# Altium schematic sheet TFT Display Interface.SchDoc
size A4; Organization: TESLA Motors, INC; Address1: 3500 Deer Creek Road; Address2: Palo Alto, CA; Address4: U.S.A.; SheetNumber: 4; SheetTotal: 21
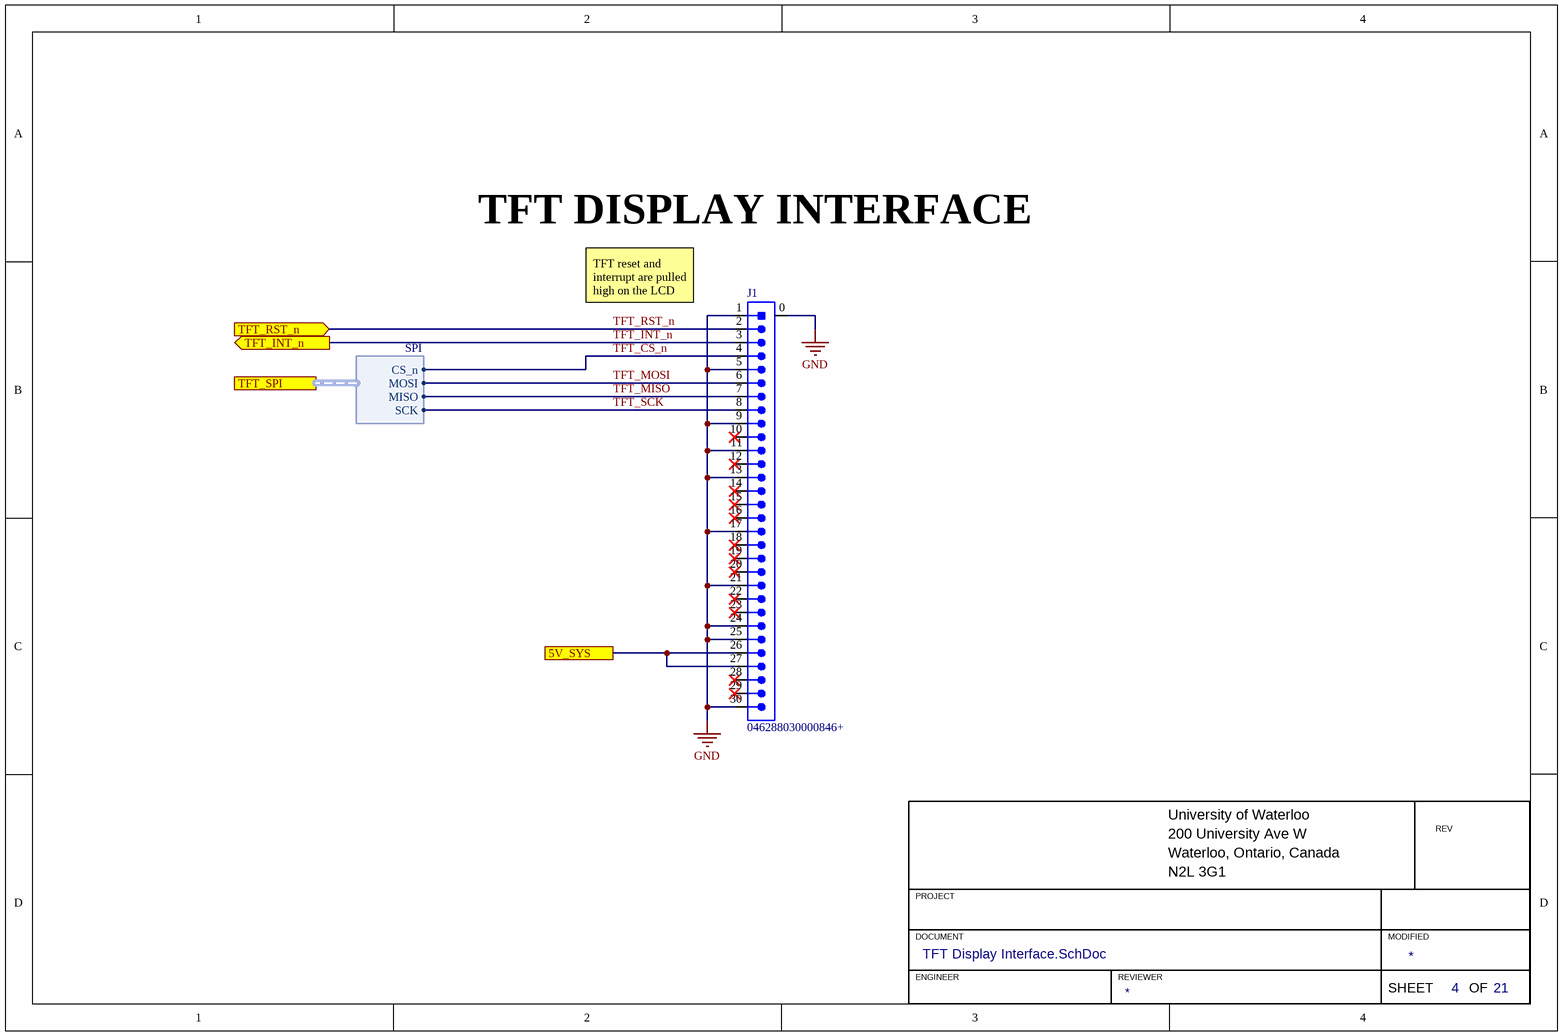
[diagram p0: TFT Display Interface.SchDoc]

## Parts
J1  Manufacturer Part Number 1: 046288030000846+  [MOLEX_FFC_30P_RA]  (hidden comment: CON_MOLEX-FFC_30P_RA)

## Ports
5V_SYS, TFT_INT_n (out), TFT_RST_n (in), TFT_SPI (harness SPI)

## Harnesses
SPI: CS_n, MOSI, MISO, SCK

## Nets
GND: J1.0 J1.1 J1.5 J1.9 J1.11 J1.13 J1.17 J1.21 J1.24 J1.25 J1.30
5V_SYS: J1.26 J1.27 ; port 5V_SYS
TFT_CS_n: J1.4 ; port TFT_SPI.CS_n
TFT_INT_n: J1.3 ; port TFT_INT_n
TFT_MISO: J1.7 ; port TFT_SPI.MISO
TFT_MOSI: J1.6 ; port TFT_SPI.MOSI
TFT_RST_n: J1.2 ; port TFT_RST_n
TFT_SCK: J1.8 ; port TFT_SPI.SCK

Not connected (* = marked no-connect by the designer): J1 10* 12* 14* 15* 16* 18* 19* 20* 22* 23* 28* 29*

## Notes on the sheet
- TFT DISPLAY INTERFACE
- TFT reset and interrupt are pulled high on the LCD module
- University of Waterloo
- 200 University Ave W
- REV
- PROJECT
- Waterloo, Ontario, Canada
- N2L 3G1
- DOCUMENT
- ENGINEER
- REVIEWER
- MODIFIED
- SHEET
- OF

## Library data of the parts
J1 = CON_MOLEX-FFC_30P_RA: CONN FFC BOTTOM 30POS 0.5MM R/A; Manufacturer 1: Molex; Package/Footprint: SMD; Current Rating: 0.4A; Voltage Rating: 50V; Supplier 1: Digi-Key; Mounting Type: SMD; Orientation: Right Angle; Pitch: 0.5mm; Supplier Part Number 1: 478-046288030000846+CT-ND